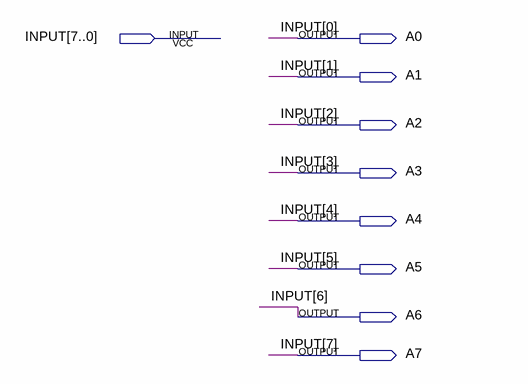
[diagram p0: schematic sheet]
// Quartus schematic BusDecoder8.bdf as structural Verilog: 0 symbols, 9 pins
module BusDecoder8 (
  input  [7:0] INPUT,
  output A0,
  output A1,
  output A2,
  output A3,
  output A4,
  output A5,
  output A6,
  output A7
);


  assign A0 = INPUT[0];
  assign A1 = INPUT[1];
  assign A2 = INPUT[2];
  assign A3 = INPUT[3];
  assign A4 = INPUT[4];
  assign A5 = INPUT[5];
  assign A6 = INPUT[6];
  assign A7 = INPUT[7];
endmodule
